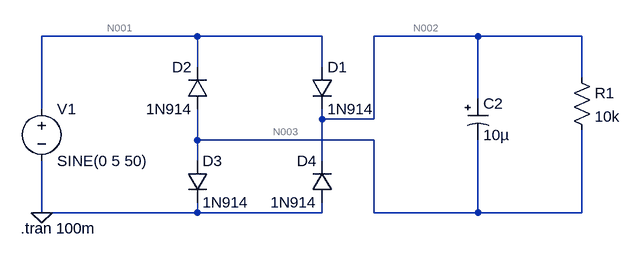
[diagram p0: schematic Draft3.asc]
Draft3.asc, the LTspice schematic file:
Version 4
SHEET 1 980 680
WIRE 320 16 80 16
WIRE 512 16 320 16
WIRE 752 16 592 16
WIRE 912 16 752 16
WIRE 320 64 320 16
WIRE 512 64 512 16
WIRE 912 80 912 16
WIRE 752 112 752 16
WIRE 80 128 80 16
WIRE 512 144 512 128
WIRE 592 144 592 16
WIRE 592 144 512 144
WIRE 320 176 320 128
WIRE 592 176 320 176
WIRE 320 208 320 176
WIRE 512 208 512 144
WIRE 80 288 80 208
WIRE 320 288 320 272
WIRE 320 288 80 288
WIRE 512 288 512 272
WIRE 512 288 320 288
WIRE 592 288 592 176
WIRE 752 288 752 176
WIRE 752 288 592 288
WIRE 912 288 912 160
WIRE 912 288 752 288
FLAG 80 288 0
SYMBOL voltage 80 112 R0
WINDOW 123 0 0 Left 0
WINDOW 39 0 0 Left 0
SYMATTR InstName V1
SYMATTR Value SINE(0 5 50)
SYMBOL polcap 736 112 R0
SYMATTR InstName C2
SYMATTR Value 10µ
SYMBOL diode 304 208 R0
SYMATTR InstName D3
SYMATTR Value 1N914
SYMBOL diode 336 128 R180
WINDOW 0 24 64 Left 2
WINDOW 3 24 0 Left 2
SYMATTR InstName D2
SYMATTR Value 1N914
SYMBOL diode 528 272 R180
WINDOW 0 24 64 Left 2
WINDOW 3 24 0 Left 2
SYMATTR InstName D4
SYMATTR Value 1N914
SYMBOL diode 496 64 R0
SYMATTR InstName D1
SYMATTR Value 1N914
SYMBOL res 896 64 R0
SYMATTR InstName R1
SYMATTR Value 10k
TEXT 48 312 Left 2 !.tran 100m

The netlist it stands for:
* Draft3.asc
V1 N001 0 SINE(0 5 50)
C2 N002 N003 10µ
D3 N003 0 1N914
D2 N003 N001 1N914
D4 0 N002 1N914
D1 N001 N002 1N914
R1 N002 N003 10k
.model D D
.lib standard.dio
.tran 100m
.backanno
.end

* Results of the author's LTspice run, read from the files saved beside the schematic
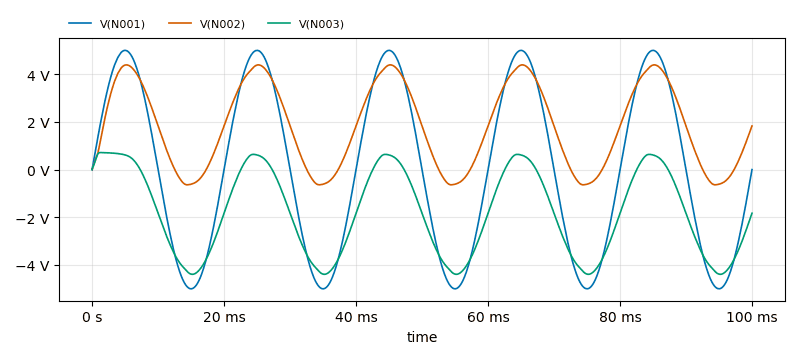
[diagram p1: Transient Analysis of Draft3.asc, plotted from the saved traces]
* Transient Analysis, 1 run:
*   V(N001): min -5 V, max 5 V, average -39.92 µV, rms 3.539 V, last 0 V
*   V(N002): min -638.2 mV, max 4.393 V, average 1.796 V, rms 2.518 V, last 1.831 V
*   V(N003): min -4.393 V, max 713.7 mV, average -1.796 V, rms 2.549 V, last -1.831 V